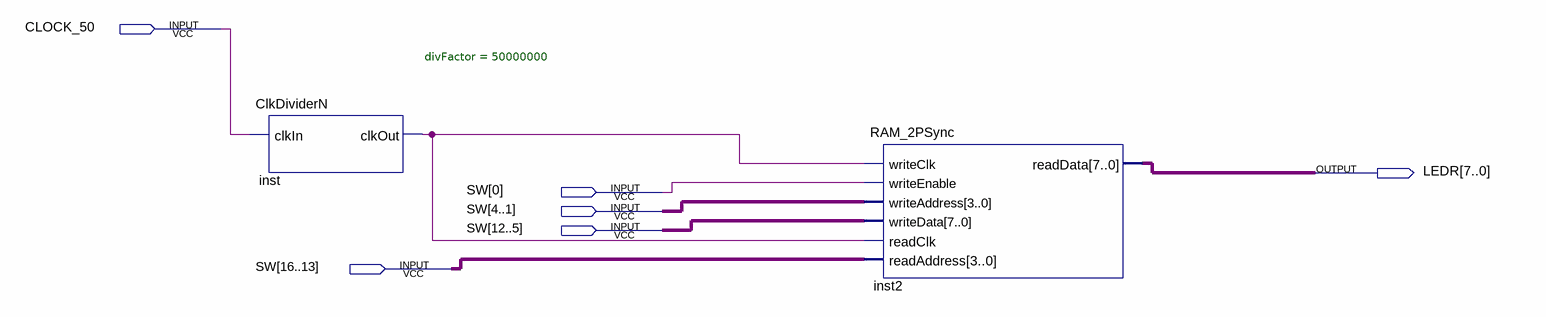
[diagram p0: schematic sheet]
// Quartus schematic RAM_2PSync_Demo.bdf as structural Verilog: 2 symbols, 6 pins
module RAM_2PSync_Demo (
  input  CLOCK_50,
  input  [16:0] SW,
  output [7:0] LEDR
);

  wire inst_clkout;

  ClkDividerN #(.divFactor(50000000)) inst (.clkIn(CLOCK_50), .clkOut(inst_clkout));
  RAM_2PSync inst2 (
    .writeClk(inst_clkout), .writeEnable(SW[0]), .writeAddress(SW[4:1]), .writeData(SW[12:5]),
    .readClk(inst_clkout), .readAddress(SW[16:13]), .readData(LEDR));
endmodule
